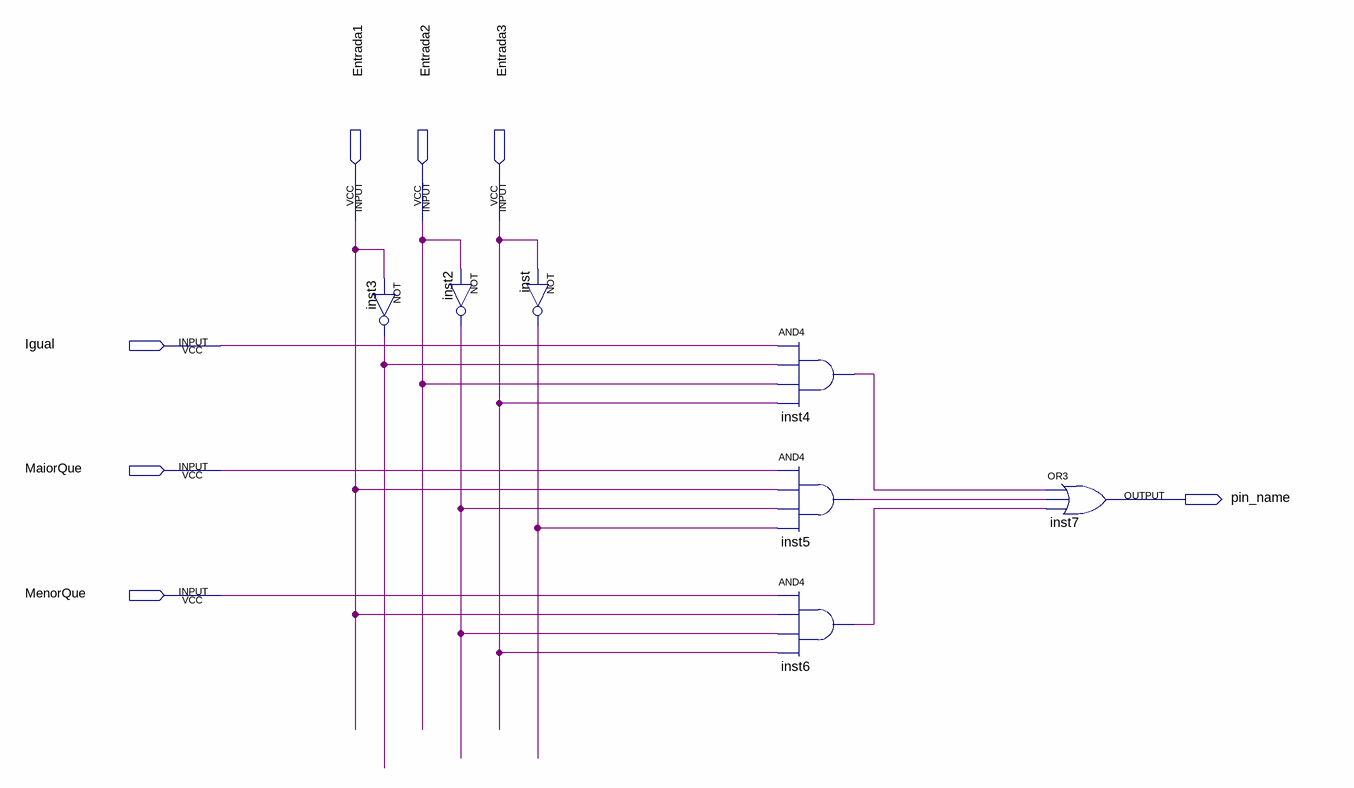
[diagram p0: schematic sheet]
// Quartus schematic Multiplex_bit_completo.bdf as structural Verilog: 7 symbols, 7 pins
module Multiplex_bit_completo (
  input  Entrada1,
  input  Entrada2,
  input  Entrada3,
  input  Igual,
  input  MaiorQue,
  input  MenorQue,
  output pin_name
);

  wire inst2_out, inst3_out, inst4_out, inst5_out, inst6_out, inst_out;

  not inst3 (inst3_out, Entrada1);
  not inst2 (inst2_out, Entrada2);
  not inst (inst_out, Entrada3);
  and inst4 (inst4_out, Igual, inst3_out, Entrada2, Entrada3);
  and inst5 (inst5_out, MaiorQue, Entrada1, inst2_out, inst_out);
  and inst6 (inst6_out, MenorQue, Entrada1, inst2_out, Entrada3);
  or inst7 (pin_name, inst4_out, inst5_out, inst6_out);
endmodule
